# Altium schematic sheet FPGA_H.SchDoc: FIT_PM12 board
size 420 x 297 mm; CheckedBy: G.Kasprowicz; Author: INR Moscow; CompanyName: WUT ISE; DrawnBy: M.Podgórski; Organization: WUT ISE; Address1: PW ISE; Address2: Nowowiejska 15/19 00-665 Warsaw; Address3: gkasprow@gmail.com; DocumentNumber: 29; Revision: 2; SheetNumber: 27; SheetTotal: 34; ModifiedBy: -; CheckedDate: -; Title2: FPGA H TDC1; DivGrp: WUT ISE; Designer: INR RAS; ModifiedDate: -; ProjectName: Sensor Box
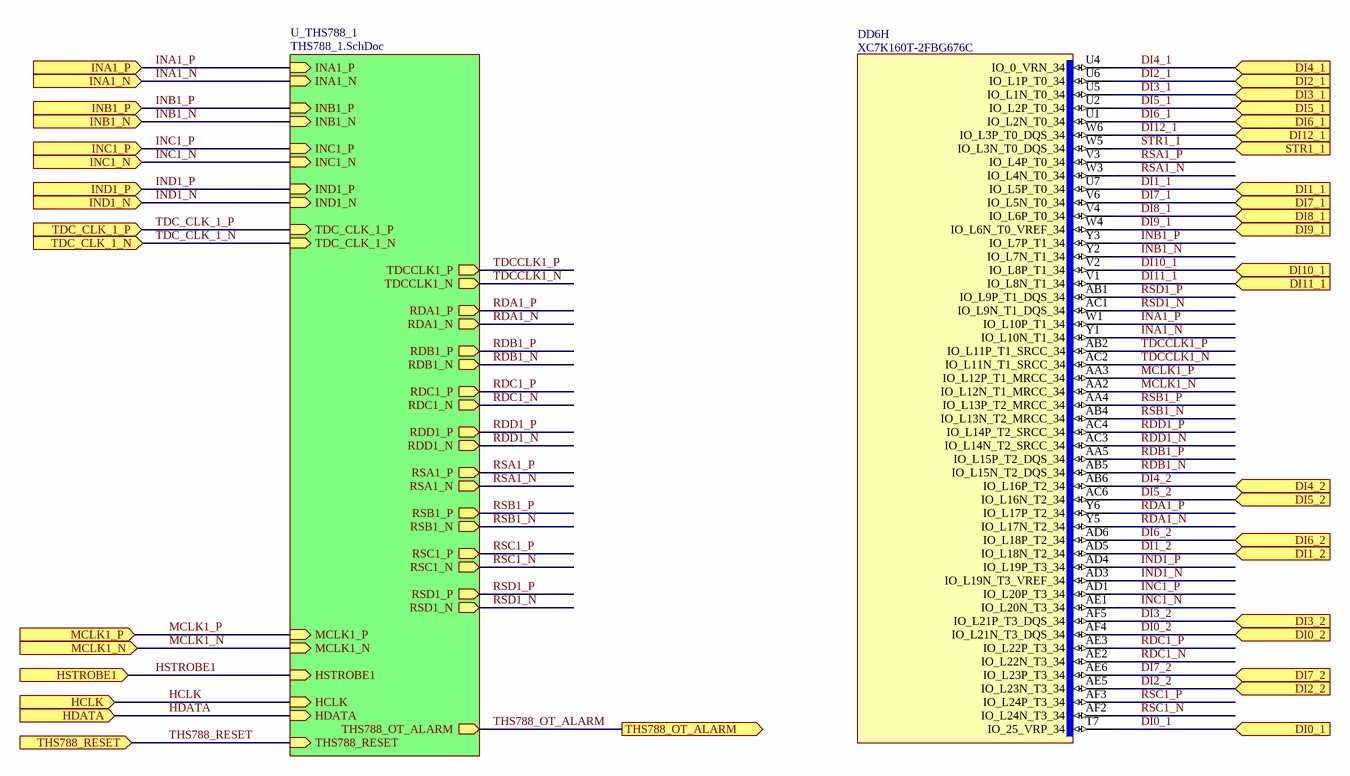
[diagram p0: FPGA_H.SchDoc]

## Parts
DD6  XC7K160T-2FBG676C  [BGA676C100P26X26_2700X2700X254]  (part H of 15)

## Sub-sheets
U_THS788_1 = THS788_1.SchDoc: INC1_P (in), INC1_N (in), IND1_N (in), IND1_P (in), RDD1_P (out), RDD1_N (out), RSD1_P (out), RSD1_N (out), HDATA (in), HCLK (in), HSTROBE1 (in), TDCCLK1_P (out), TDCCLK1_N (out), RSB1_P (out), RSB1_N (out), RDB1_P (out), RDB1_N (out), THS788_OT_ALARM (out), THS788_RESET (in), MCLK1_N (in), MCLK1_P (in), INB1_N (in), INB1_P (in), TDC_CLK_1_P (in), TDC_CLK_1_N (in), INA1_P (in), INA1_N (in), RDA1_N (out), RDA1_P (out), RSA1_P (out), RSA1_N (out), RSC1_N (out), RSC1_P (out), RDC1_N (out), RDC1_P (out)

## Ports
DI0_1 (in), DI0_2 (in), DI1_1 (in), DI1_2 (in), DI2_1 (in), DI2_2 (in), DI3_1 (in), DI3_2 (in), DI4_1 (in), DI4_2 (in), DI5_1 (in), DI5_2 (in), DI6_1 (in), DI6_2 (in), DI7_1 (in), DI7_2 (in), DI8_1 (in), DI9_1 (in), DI10_1 (in), DI11_1 (in), DI12_1 (in), HCLK (in), HDATA (in), HSTROBE1 (in), INA1_N (in), INA1_P (in), INB1_N (in), INB1_P (in), INC1_N (in), INC1_P (in), IND1_N (in), IND1_P (in), MCLK1_N (in), MCLK1_P (in), STR1_1 (in), TDC_CLK_1_N (in), TDC_CLK_1_P (in), THS788_OT_ALARM (out), THS788_RESET (in)

## Nets
DI0_1: DD6.T7(IO_25_VRP_34) ; port DI0_1
DI0_2: DD6.AF4(IO_L21N_T3_DQS_34) ; port DI0_2
DI1_1: DD6.U7(IO_L5P_T0_34) ; port DI1_1
DI1_2: DD6.AD5(IO_L18N_T2_34) ; port DI1_2
DI2_1: DD6.U6(IO_L1P_T0_34) ; port DI2_1
DI2_2: DD6.AE5(IO_L23N_T3_34) ; port DI2_2
DI3_1: DD6.U5(IO_L1N_T0_34) ; port DI3_1
DI3_2: DD6.AF5(IO_L21P_T3_DQS_34) ; port DI3_2
DI4_1: DD6.U4(IO_0_VRN_34) ; port DI4_1
DI4_2: DD6.AB6(IO_L16P_T2_34) ; port DI4_2
DI5_1: DD6.U2(IO_L2P_T0_34) ; port DI5_1
DI5_2: DD6.AC6(IO_L16N_T2_34) ; port DI5_2
DI6_1: DD6.U1(IO_L2N_T0_34) ; port DI6_1
DI6_2: DD6.AD6(IO_L18P_T2_34) ; port DI6_2
DI7_1: DD6.V6(IO_L5N_T0_34) ; port DI7_1
DI7_2: DD6.AE6(IO_L23P_T3_34) ; port DI7_2
DI8_1: DD6.V4(IO_L6P_T0_34) ; port DI8_1
DI9_1: DD6.W4(IO_L6N_T0_VREF_34) ; port DI9_1
DI10_1: DD6.V2(IO_L8P_T1_34) ; port DI10_1
DI11_1: DD6.V1(IO_L8N_T1_34) ; port DI11_1
DI12_1: DD6.W6(IO_L3P_T0_DQS_34) ; port DI12_1
HCLK: port HCLK, sheet U_THS788_1/HCLK
HDATA: port HDATA, sheet U_THS788_1/HDATA
HSTROBE1: port HSTROBE1, sheet U_THS788_1/HSTROBE1
INA1_N: DD6.Y1(IO_L10N_T1_34) ; port INA1_N, sheet U_THS788_1/INA1_N
INA1_P: DD6.W1(IO_L10P_T1_34) ; port INA1_P, sheet U_THS788_1/INA1_P
INB1_N: DD6.Y2(IO_L7N_T1_34) ; port INB1_N, sheet U_THS788_1/INB1_N
INB1_P: DD6.Y3(IO_L7P_T1_34) ; port INB1_P, sheet U_THS788_1/INB1_P
INC1_N: DD6.AE1(IO_L20N_T3_34) ; port INC1_N, sheet U_THS788_1/INC1_N
INC1_P: DD6.AD1(IO_L20P_T3_34) ; port INC1_P, sheet U_THS788_1/INC1_P
IND1_N: DD6.AD3(IO_L19N_T3_VREF_34) ; port IND1_N, sheet U_THS788_1/IND1_N
IND1_P: DD6.AD4(IO_L19P_T3_34) ; port IND1_P, sheet U_THS788_1/IND1_P
MCLK1_N: DD6.AA2(IO_L12N_T1_MRCC_34) ; port MCLK1_N, sheet U_THS788_1/MCLK1_N
MCLK1_P: DD6.AA3(IO_L12P_T1_MRCC_34) ; port MCLK1_P, sheet U_THS788_1/MCLK1_P
RDA1_N: DD6.Y5(IO_L17N_T2_34) ; sheet U_THS788_1/RDA1_N
RDA1_P: DD6.Y6(IO_L17P_T2_34) ; sheet U_THS788_1/RDA1_P
RDB1_N: DD6.AB5(IO_L15N_T2_DQS_34) ; sheet U_THS788_1/RDB1_N
RDB1_P: DD6.AA5(IO_L15P_T2_DQS_34) ; sheet U_THS788_1/RDB1_P
RDC1_N: DD6.AE2(IO_L22N_T3_34) ; sheet U_THS788_1/RDC1_N
RDC1_P: DD6.AE3(IO_L22P_T3_34) ; sheet U_THS788_1/RDC1_P
RDD1_N: DD6.AC3(IO_L14N_T2_SRCC_34) ; sheet U_THS788_1/RDD1_N
RDD1_P: DD6.AC4(IO_L14P_T2_SRCC_34) ; sheet U_THS788_1/RDD1_P
RSA1_N: DD6.W3(IO_L4N_T0_34) ; sheet U_THS788_1/RSA1_N
RSA1_P: DD6.V3(IO_L4P_T0_34) ; sheet U_THS788_1/RSA1_P
RSB1_N: DD6.AB4(IO_L13N_T2_MRCC_34) ; sheet U_THS788_1/RSB1_N
RSB1_P: DD6.AA4(IO_L13P_T2_MRCC_34) ; sheet U_THS788_1/RSB1_P
RSC1_N: DD6.AF2(IO_L24N_T3_34) ; sheet U_THS788_1/RSC1_N
RSC1_P: DD6.AF3(IO_L24P_T3_34) ; sheet U_THS788_1/RSC1_P
RSD1_N: DD6.AC1(IO_L9N_T1_DQS_34) ; sheet U_THS788_1/RSD1_N
RSD1_P: DD6.AB1(IO_L9P_T1_DQS_34) ; sheet U_THS788_1/RSD1_P
STR1_1: DD6.W5(IO_L3N_T0_DQS_34) ; port STR1_1
TDC_CLK_1_N: port TDC_CLK_1_N, sheet U_THS788_1/TDC_CLK_1_N
TDC_CLK_1_P: port TDC_CLK_1_P, sheet U_THS788_1/TDC_CLK_1_P
TDCCLK1_N: DD6.AC2(IO_L11N_T1_SRCC_34) ; sheet U_THS788_1/TDCCLK1_N
TDCCLK1_P: DD6.AB2(IO_L11P_T1_SRCC_34) ; sheet U_THS788_1/TDCCLK1_P
THS788_OT_ALARM: port THS788_OT_ALARM, sheet U_THS788_1/THS788_OT_ALARM
THS788_RESET: port THS788_RESET, sheet U_THS788_1/THS788_RESET

## Notes on the sheet
- Project/Equipment
- Document
- Designer
- Drawn by
- Check.by
- Copyright WUT ISE 2024.
  This documentation describes Open Hardware and is licensed under the CERN OHL v.2. You may redistribute and modify this documentation under the terms of the CERN OHL v.2. (http://ohwr.org/CERNOHL). This documentation is distributed WITHOUT ANY EXPRESS OR IMPLIED WARRANTY, INCLUDING OF MERCHANTABILITY, SATISFACTORY QUALITY AND FITNESS FOR A PARTICULAR PURPOSE. Please see the CERN OHL v.2 for applicable conditions.
- Contact
- File
- Last Mod.
- Print Date
- Sheet
- Size
- A3
- of
- Rev

## Library data of the parts
DD6 = XC7K160T-2FBG676C: KINTEX-7, FPGA, 676-Ball BGA, Pb-Free; Part Description: KINTEX-7 FPGA, 162240 Logic Cells, 400 User I/O, 8 GTXs, 676-Ball BGA, Speed Grade 2, Commercial Grade, Pb-Free; Manufacturer: XILINX; PressFit: No; Bonding: No; Part Number: XC7K160T-2FBG676C; Component Kind: Standard; Component Type: Standard; Device: XC7K160T-2FBG676C; PackageDescription: BGA, 1.00mm Pitch, Square; 676 Pin, 26 Columns X 26 Rows, Body 27.0mm X 27.0mm X 2.54mm H, IPC Medium Density; Manufacturer Part Number: XC7K160T-2FBG676C; Pin Count: 676; Case: BGA676; Mounted: Yes; Socket: No; SMD: Yes; Sense: No; ComponentHeight: 2.54mm; HelpURL: \\cern.ch\dfs\Applications\Altium\Datasheets\XC7K160T-xFBG676C.pdf; ComponentLink1URL: \\cern.ch\dfs\Applications\Altium\Datasheets\XC7K160T-xFBG676C_Package-Pinout.pdf; ComponentLink1Description: Package/Pinout; Author: CERN DEM BC; CreateDate: 06.02.2020; LatestRevisionDate: 06.02.2020